# Altium schematic sheet [08] - ASSEMBLIES.SchDoc
size A4
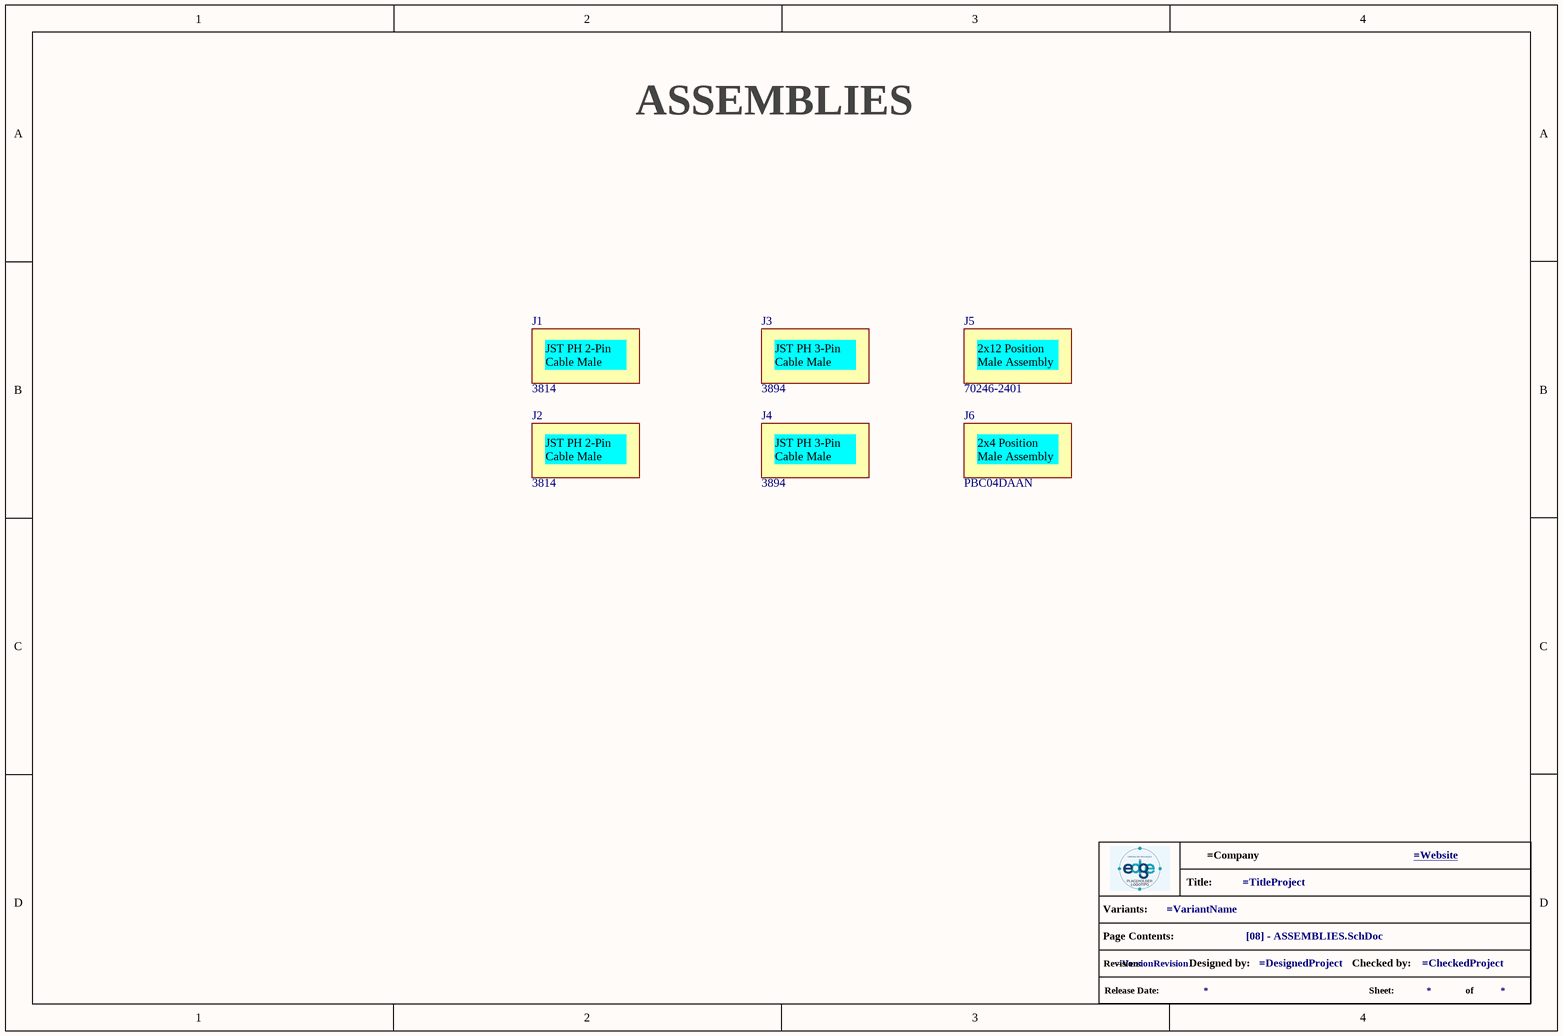
[diagram p0: [08] - ASSEMBLIES.SchDoc]

## Parts
GPH?  info_project  (value not drawn)  (graphical)
J1  3814  (mechanical)
J2  3814  (mechanical)
J3  3894  (mechanical)
J4  3894  (mechanical)
J5  70246-2401  (mechanical)
J6  PBC04DAAN  (mechanical)

## Notes on the sheet
- ASSEMBLIES
- (in symbol 3814) JST PH 2-Pin Cable Male
- (in symbol 3894) JST PH 3-Pin Cable Male
- (in symbol 70246-2401) 2x12 Position Male Assembly
- (in symbol info_project) Title:; Variants:; Page Contents:; Revision:; Designed by:; Checked by:; Release Date:; Sheet:; of
- (in symbol PBC04DAAN) 2x4 Position Male Assembly

## Library data of the parts
GPH? = info_project: GRAPHICAL - Info Project
J1 J2 = 3814: ASSEMBLY - JST PH 2-Pin Cable Male Header 200mm | Adafruit Industries 3814; Supplier: DigiKey; Supplier Part Number: 1528-2617-ND; Manufacturer 1: Adafruit Industries; Manufacturer Part Number: 3814; Category: Rectangular Connectors; Stock: 1710; Pricing: 1=0,75 (USD); Schedule B: 8544420000, 8544420000|8544420000|8544420000|8544420000|8544420000; .SCHChecked: *
J3 J4 = 3894: ASSEMBLY - Cable Assembly, 3 Conductor(s), Flexible Cord And Fixture Wire; Manufacturer 1: Adafruit Industries; Cable Length: 200mm; Number of Conductors: 3; Shielding: No; Supplier: Arrow Electronics; Supplier Part Number: 3894; Manufacturer Part Number 1: 3894; RoHS: Compliant; Category: Cables and Wire; Stock: 716; Pricing: 1=0,236 (USD); Schedule B: 8544420000, 8544420000|8544420000|8544420000|8544420000|8544420000; ComponentLink1URL: https://datasheet.octopart.com:443/3894-Adafruit-Industries-datasheet-182218805.pdf?src-supplier=IHS; ComponentLink1Description: https://datasheet.octopart.com:443/3894-Adafruit-Industries-datasheet-182218805.pdf?src-supplier=IHS; .SCHChecked: *
J5 = 70246-2401: ASSEMBLY - Conn Shrouded Header (4 Sides) HDR 24 POS 2.54mm Solder ST Top Entry Thru-Hole C-Grid® Tray; Manufacturer 1: Molex; Manufacturer Lifecycle Status: ACTIVE; Connector Type: Male Pin; Contact Resistance: 15mΩ; Current Rating: 2.5A; Gender: Male; Glow Wire Compliant: Non-compliant; Insulation Resistance: 12GΩ; Max Voltage Rating (AC): 250V; Number of Circuits: 20; Number of Contacts: 24; Plating: Tin; Plating Thickness: 381nm; Supplier: Newark; Supplier Part Number: 70246-2401; Manufacturer Part Number 1: 70246-2401; RoHS: Compliant; Category: Headers and Wire Housings; Stock: 2743; Pricing: 81=1,91, 100=1,67, 250=1,61, 500=1,55, 1000=1,48 (USD); China RoHS: Compliant; Color: Black; Contact Gender: Male; Contact Material: Bronze; Contact Mating Length: 6.096mm; Contact Plating: Gold; Country of Origin: SG; ELV: Compliant; Flammability Rating: UL94 V-0; Housing Color: Black; Housing Material: Polyester; Lead Free: Lead Free; Lifecycle Status: Production; Max Operating Temperature: 120°C; Min Operating Temperature: -55°C; Mounting Technology: Through Hole; Pins: 24; Number of Positions: 24; Number of Rows: 2; Orientation: Vertical; Pitch: 2.54mm; REACH SVHC: Yes; Row Spacing: 2.54mm; Terminal Pitch: 2.54mm; Termination: Solder; Voltage Rating: 250V; ComponentLink1URL: https://datasheet.octopart.com:443/70246-2401-Molex-datasheet-13789974.pdf?src-supplier=Sager+Electronics; ComponentLink1Description: https://datasheet.octopart.com:443/70246-2401-Molex-datasheet-13789974.pdf?src-supplier=Sager+Electronics; ComponentLink2URL: https://sigma.octopart.com:443/15650474/technical_drawing/Molex-70246-2401.pdf?src-supplier=Molex; ComponentLink2Description: https://sigma.octopart.com:443/15650474/technical_drawing/Molex-70246-2401.pdf?src-supplier=Molex; ComponentLink3URL: https://datasheet.octopart.com:443/702462401-Molex-datasheet-8335533.pdf?src-supplier=Verical; ComponentLink3Description: https://datasheet.octopart.com:443/702462401-Molex-datasheet-8335533.pdf?src-supplier=Verical; ComponentLink4URL: https://datasheet.octopart.com:443/70246-2401-Molex-datasheet-5315796.pdf?src-supplier=Verical; ComponentLink4Description: https://datasheet.octopart.com:443/70246-2401-Molex-datasheet-5315796.pdf?src-supplier=Verical; ComponentLink5URL: https://datasheet.octopart.com:443/70246-2401-Molex-datasheet-154757668.pdf?src-supplier=Master+Electronics; ComponentLink5Description: https://datasheet.octopart.com:443/70246-2401-Molex-datasheet-154757668.pdf?src-supplier=Master+Electronics; ComponentLink6URL: https://datasheet.octopart.com:443/70246-2401-Molex-datasheet-168217419.pdf?src-supplier=TME; ComponentLink6Description: https://datasheet.octopart.com:443/70246-2401-Molex-datasheet-168217419.pdf?src-supplier=TME; ComponentLink7URL: https://datasheet.octopart.com:443/70246-2401-Molex-datasheet-140187450.pdf?src-supplier=RS+(Formerly+Allied+Electronics); ComponentLink7Description: https://datasheet.octopart.com:443/70246-2401-Molex-datasheet-140187450.pdf?src-supplier=RS+(Formerly+Allied+Electronics); ComponentLink8URL: https://datasheet.octopart.com:443/70246-2401-Molex-datasheet-120155468.pdf?src-supplier=RS+(Formerly+Allied+Electronics); ComponentLink8Description: https://datasheet.octopart.com:443/70246-2401-Molex-datasheet-120155468.pdf?src-supplier=RS+(Formerly+Allied+Electronics); ComponentLink9URL: https://datasheet.octopart.com:443/70246-2401-Molex-datasheet-62105713.pdf?src-supplier=Electro+Sonic; ComponentLink9Description: https://datasheet.octopart.com:443/70246-2401-Molex-datasheet-62105713.pdf?src-supplier=Electro+Sonic; ComponentLink10URL: https://datasheet.octopart.com:443/70246-2401-Molex-datasheet-37171966.pdf?src-supplier=Electro+Sonic; ComponentLink10Description: https://datasheet.octopart.com:443/70246-2401-Molex-datasheet-37171966.pdf?src-supplier=Electro+Sonic; ComponentLink11URL: https://datasheet.octopart.com:443/70246-2401-Molex-datasheet-23710771.pdf?src-supplier=Electro+Sonic; ComponentLink11Description: https://datasheet.octopart.com:443/70246-2401-Molex-datasheet-23710771.pdf?src-supplier=Electro+Sonic; ComponentLink12URL: https://datasheet.octopart.com:443/0702462401-Molex-datasheet-11802917.pdf?src-supplier=Arrow+Electronics; ComponentLink12Description: https://datasheet.octopart.com:443/0702462401-Molex-datasheet-11802917.pdf?src-supplier=Arrow+Electronics; ComponentLink13URL: https://datasheet.octopart.com:443/70246-2401-Molex-datasheet-138174.pdf?src-supplier=DigiKey; ComponentLink13Description: https://datasheet.octopart.com:443/70246-2401-Molex-datasheet-138174.pdf?src-supplier=DigiKey; ComponentLink14URL: http://sigma.octopart.com:80/15650497/rohs_certificate/Molex-70246-2401.pdf?src-supplier=Compliance+Statements; ComponentLink14Description: http://sigma.octopart.com:80/15650497/rohs_certificate/Molex-70246-2401.pdf?src-supplier=Compliance+Statements; ComponentLink15URL: http://sigma.octopart.com:80/conflict_mineral_statement/Molex-company-72.pdf?src-supplier=Compliance+Statements; ComponentLink15Description: http://sigma.octopart.com:80/conflict_mineral_statement/Molex-company-72.pdf?src-supplier=Compliance+Statements; ComponentLink16URL: http://sigma.octopart.com:80/rohs_statement/Molex-company-73.pdf?src-supplier=Compliance+Statements; ComponentLink16Description: http://sigma.octopart.com:80/rohs_statement/Molex-company-73.pdf?src-supplier=Compliance+Statements; ComponentLink17URL: http://sigma.octopart.com:80/reach_statement/Molex-company-74.pdf?src-supplier=Compliance+Statements; ComponentLink17Description: http://sigma.octopart.com:80/reach_statement/Molex-company-74.pdf?src-supplier=Compliance+Statements; .SCHChecked: *
J6 = PBC04DAAN: ASSEMBLY - Conn Unshrouded Header HDR 8 POS 2.54mm Solder ST Top Entry Thru-Hole; Manufacturer 1: Sullins; Connector Type: Male Pin; Contact Resistance: 30mΩ; Current Rating: 3A; Gender: Male; Insulation Resistance: 5GΩ; Number of Contacts: 8; Plating Thickness: 254nm; Supplier: DigiKey; Supplier Part Number: S2011E-04-ND; Manufacturer Part Number 1: PBC04DAAN; RoHS: Compliant; Category: Headers and Wire Housings; Stock: 15250; Pricing: 1=0,69, 10=0,583, 100=0,4955, 500=0,4422, 1000=0,42108, 5000=0,37588, 10000=0,36514 (USD); Color: Black; Contact Gender: Male; Contact Material: Gold, Nickel; Contact Mating Length: 5.842mm; Contact Plating: Gold; Height: 8.71mm; Housing Color: Black; Housing Material: Plastic; Lead Free: Lead Free; Length: 10.2mm; Lifecycle Status: Production; Max Operating Temperature: 125°C; Min Operating Temperature: -65°C; Mounting Technology: Through Hole; Pins: 8; Number of Positions: 8; Number of Rows: 2; Packaging: Bulk; Pitch: 2.54mm; REACH SVHC: Yes; Row Spacing: 2.54mm; Terminal Pitch: 2.54mm; Termination: Solder; Width: 5.08mm; ComponentLink1URL: https://datasheet.octopart.com:443/PBC04DAAN-Sullins-datasheet-137916713.pdf?src-supplier=IHS; ComponentLink1Description: https://datasheet.octopart.com:443/PBC04DAAN-Sullins-datasheet-137916713.pdf?src-supplier=IHS; ComponentLink2URL: https://datasheet.octopart.com:443/PBC04DAAN-Sullins-datasheet-102002651.pdf?src-supplier=Upverter; ComponentLink2Description: https://datasheet.octopart.com:443/PBC04DAAN-Sullins-datasheet-102002651.pdf?src-supplier=Upverter; ComponentLink3URL: https://datasheet.octopart.com:443/PBC04DAAN-Sullins-datasheet-41399297.pdf?src-supplier=Future+Electronics; ComponentLink3Description: https://datasheet.octopart.com:443/PBC04DAAN-Sullins-datasheet-41399297.pdf?src-supplier=Future+Electronics; ComponentLink4URL: https://datasheet.octopart.com:443/PBC04DAAN-Sullins-datasheet-8324602.pdf?src-supplier=Future+Electronics; ComponentLink4Description: https://datasheet.octopart.com:443/PBC04DAAN-Sullins-datasheet-8324602.pdf?src-supplier=Future+Electronics; ComponentLink5URL: https://datasheet.octopart.com:443/PBC04DAAN-Sullins-datasheet-118405.pdf?src-supplier=DigiKey; ComponentLink5Description: https://datasheet.octopart.com:443/PBC04DAAN-Sullins-datasheet-118405.pdf?src-supplier=DigiKey; .SCHChecked: *